# Altium schematic sheet TP_IHM_7SEG.SchDoc
size A4
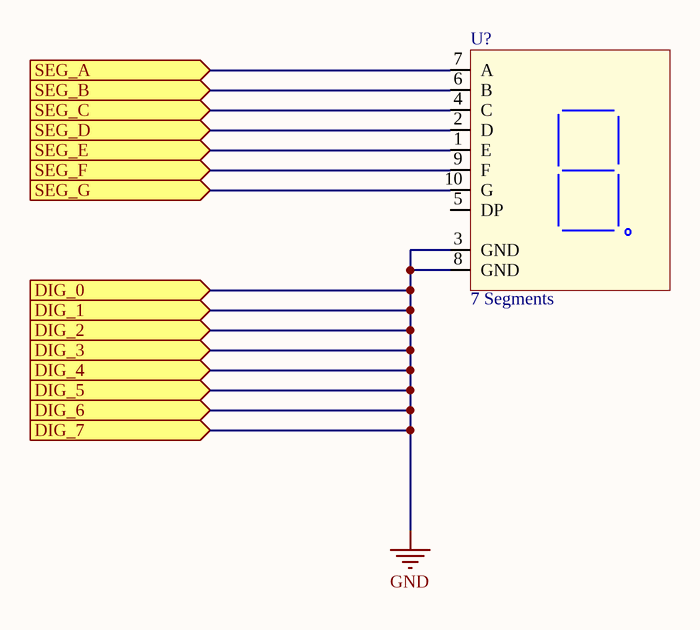
[diagram p0: TP_IHM_7SEG.SchDoc]

## Parts
U?  7 Segments  [SA10-21GWA]

## Ports
DIG_0 (in), DIG_1 (in), DIG_2 (in), DIG_3 (in), DIG_4 (in), DIG_5 (in), DIG_6 (in), DIG_7 (in), SEG_A (in), SEG_B (in), SEG_C (in), SEG_D (in), SEG_E (in), SEG_F (in), SEG_G (in)

## Nets
GND: U?.3(GND) U?.8(GND) ; port DIG_0, port DIG_1, port DIG_2, port DIG_3, port DIG_4, port DIG_5, port DIG_6, port DIG_7
SEG_A: U?.7(A) ; port SEG_A
SEG_B: U?.6(B) ; port SEG_B
SEG_C: U?.4(C) ; port SEG_C
SEG_D: U?.2(D) ; port SEG_D
SEG_E: U?.1(E) ; port SEG_E
SEG_F: U?.9(F) ; port SEG_F
SEG_G: U?.10(G) ; port SEG_G

Not connected (* = marked no-connect by the designer): U? 5(DP)

## Library data of the parts
U? = SC10-21SRWA: KingBright Led 7 Segments; Reference: SC10-21SRWA